# EAGLE design 40bus-nano32 (EAGLE 7.4.0)
CNAME: 40BUS-NANO32; CREVISION: r1; DESIGNER: lamloei.com/40bus-nano32
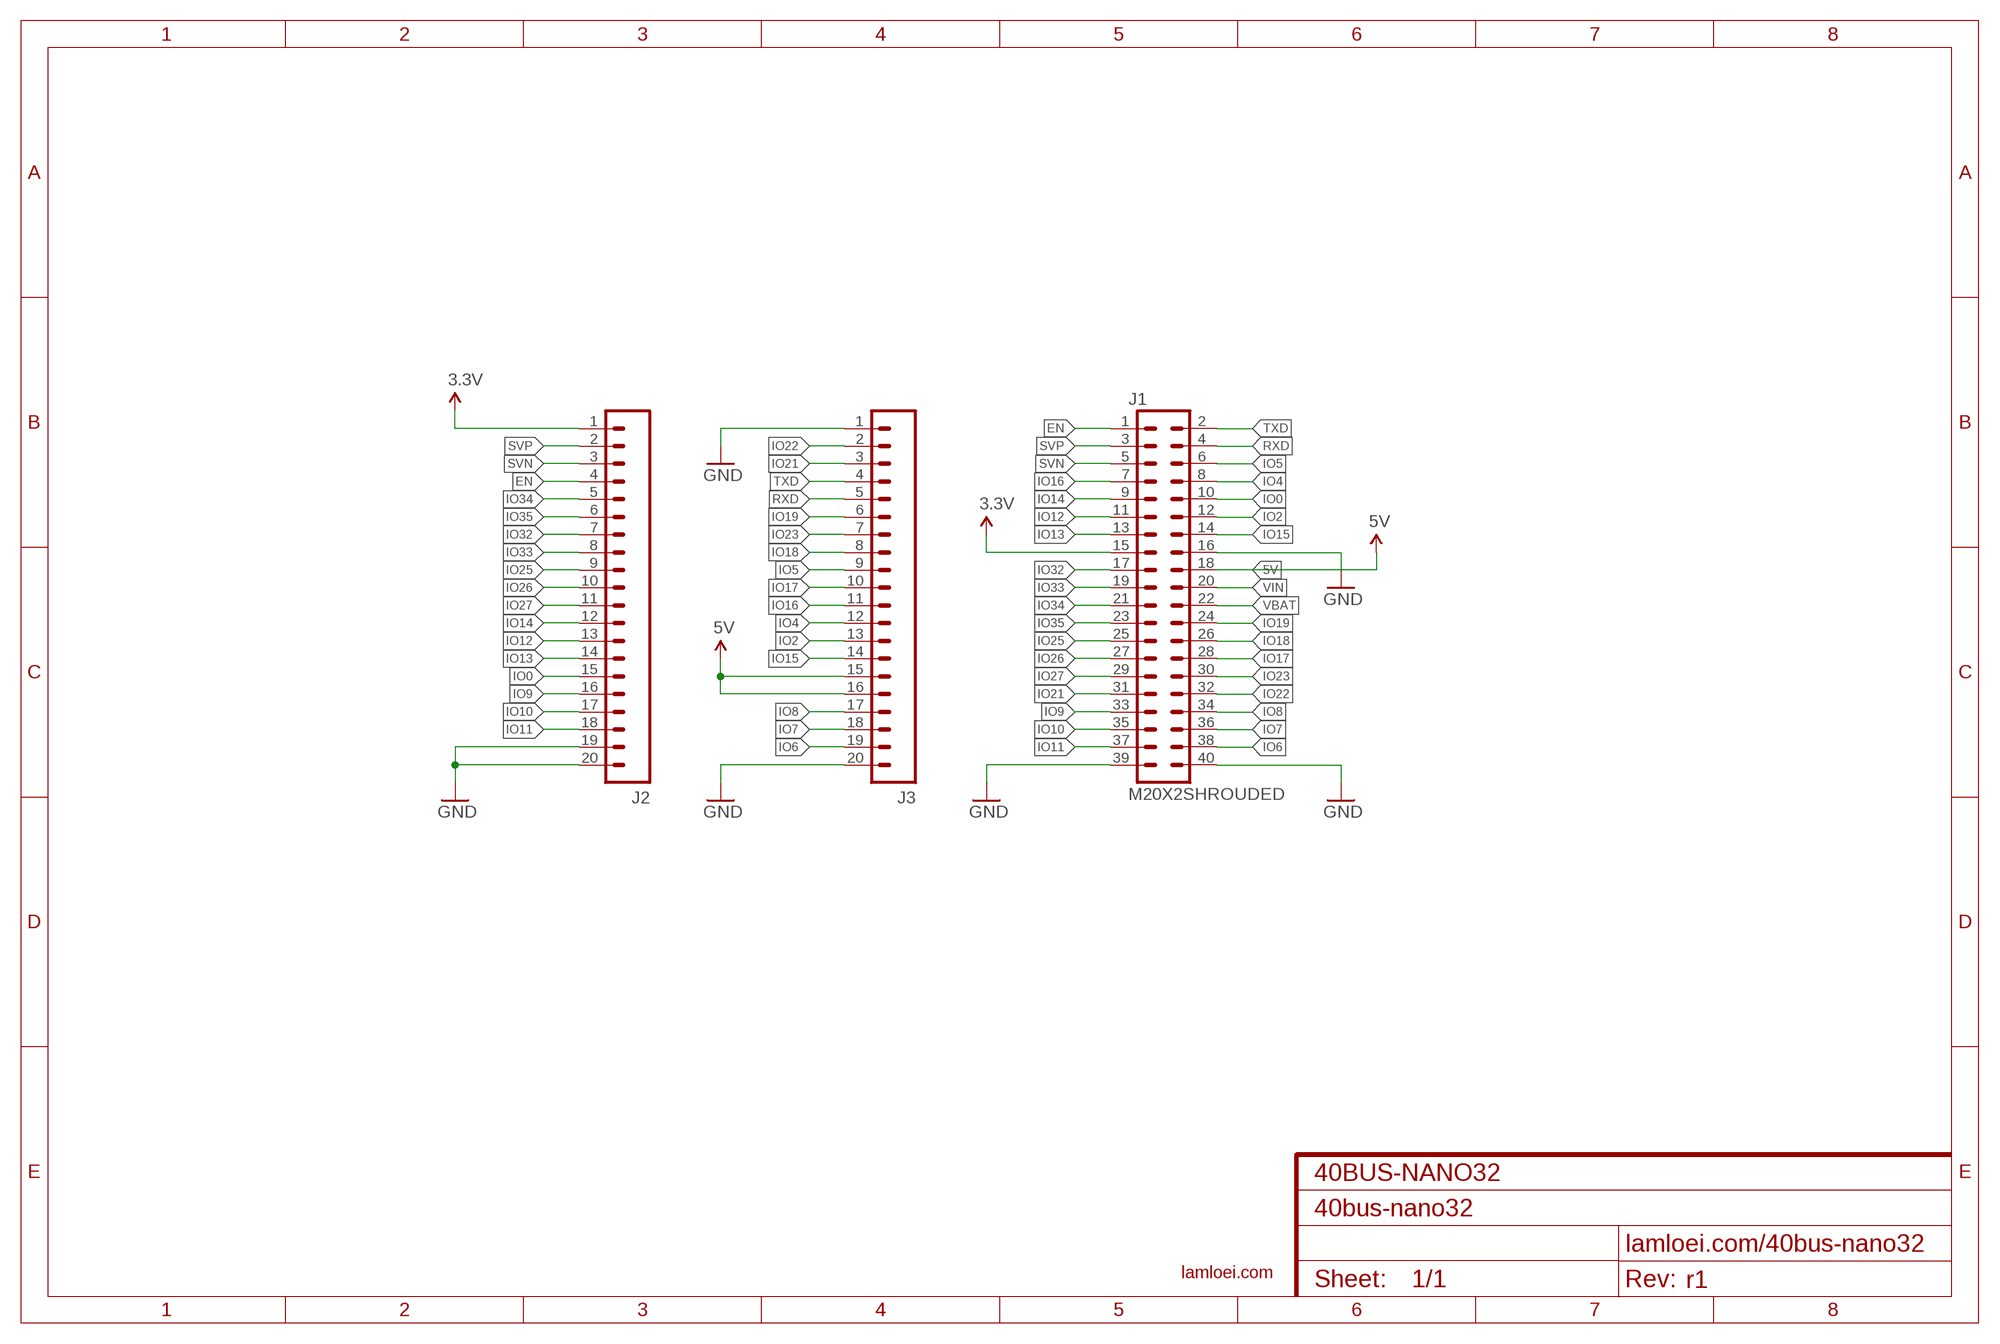
[diagram p0: schematic, sheet 1]

## Parts
J1  M20X2SHROUDED  [2X20_SHROUDED]
J2  M20  [1X20]
J3  M20  [1X20]
U$1  LAMLEOI_LOGO_3  [LAMLEOI_LOGO_3]

## Nets
3.3V: J1.15 J2.1
5V: J1.18 J3.15 J3.16
EN: J1.1 J2.4
GND: J1.16 J1.39 J1.40 J2.19 J2.20 J3.1 J3.20
IO0: J1.10 J2.15
IO2: J1.12 J3.13
IO4: J1.8 J3.12
IO5: J1.6 J3.9
IO6: J1.38 J3.19
IO7: J1.36 J3.18
IO8: J1.34 J3.17
IO9: J1.33 J2.16
IO10: J1.35 J2.17
IO11: J1.37 J2.18
IO12: J1.11 J2.13
IO13: J1.13 J2.14
IO14: J1.9 J2.12
IO15: J1.14 J3.14
IO16: J1.7 J3.11
IO17: J1.28 J3.10
IO18: J1.26 J3.8
IO19: J1.24 J3.6
IO21: J1.31 J3.3
IO22: J1.32 J3.2
IO23: J1.30 J3.7
IO25: J1.25 J2.9
IO26: J1.27 J2.10
IO27: J1.29 J2.11
IO32: J1.17 J2.7
IO33: J1.19 J2.8
IO34: J1.21 J2.5
IO35: J1.23 J2.6
RXD: J1.4 J3.5
SVN: J1.5 J2.3
SVP: J1.3 J2.2
TXD: J1.2 J3.4
VBAT: J1.22
VIN: J1.20

## Library data of the parts
J1 = SparkFun-Connectors:M20X2: 0.1" spaced headers; PROD_ID: CONN-12263
J2 J3 = SparkFun-Connectors2:M20: 1x20 .1" header This is just like the LOCK variant in that the holes are staggared by 5 mil, but except for the last two holes. They are not altered from the "standard" footprint layout. This is used for a special purpose on the layout of our Graphic LCD Backpack. Make sure you want to use this device before selecting it for you project!
U$1 = lamloei_logo_3:LAMLEOI_LOGO_3: lamloei

## Board
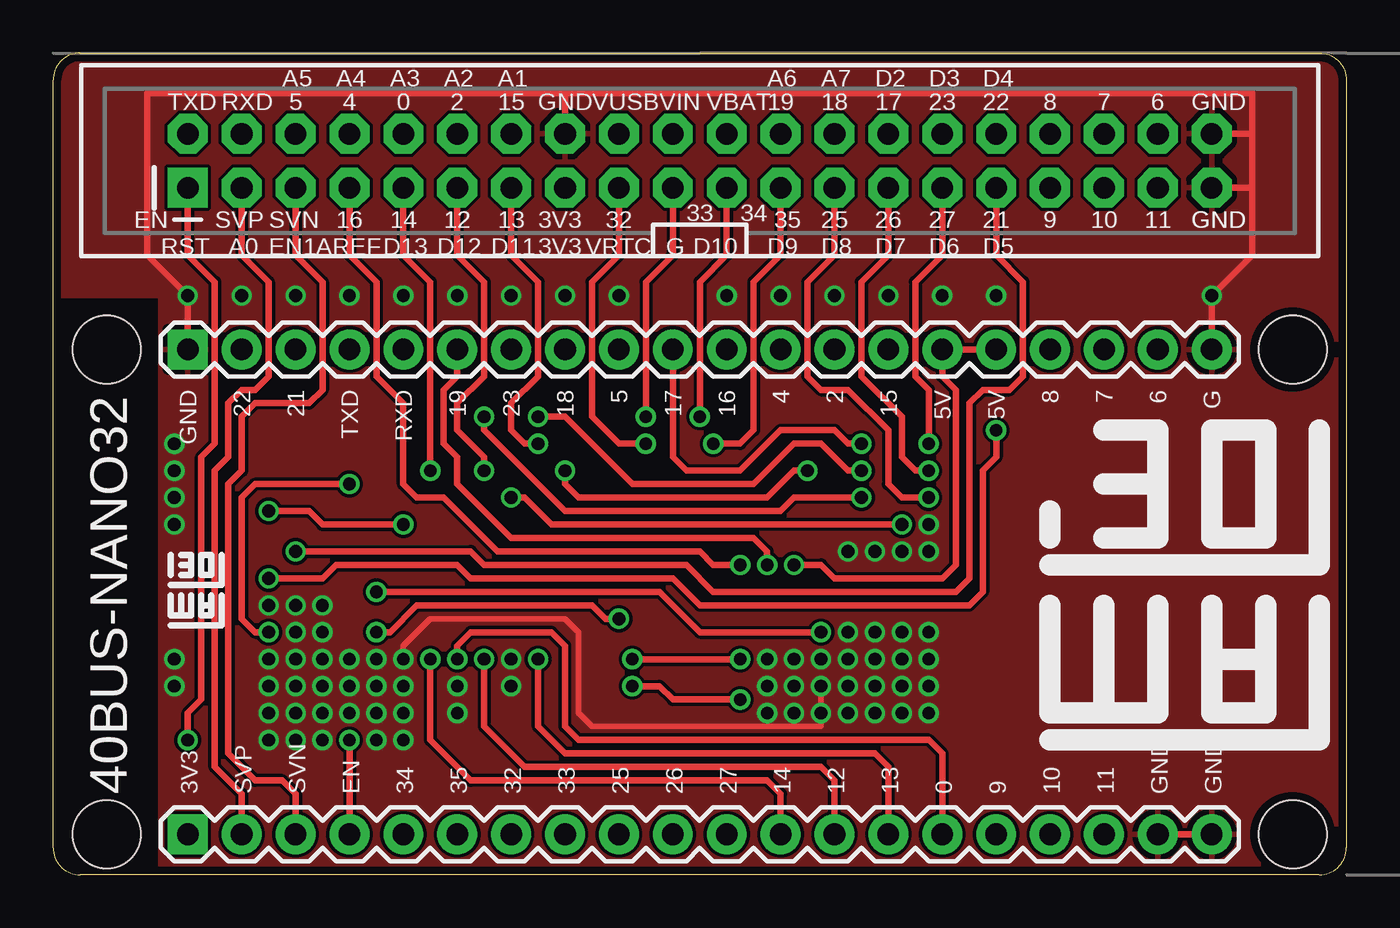
[diagram p1: board, top side]
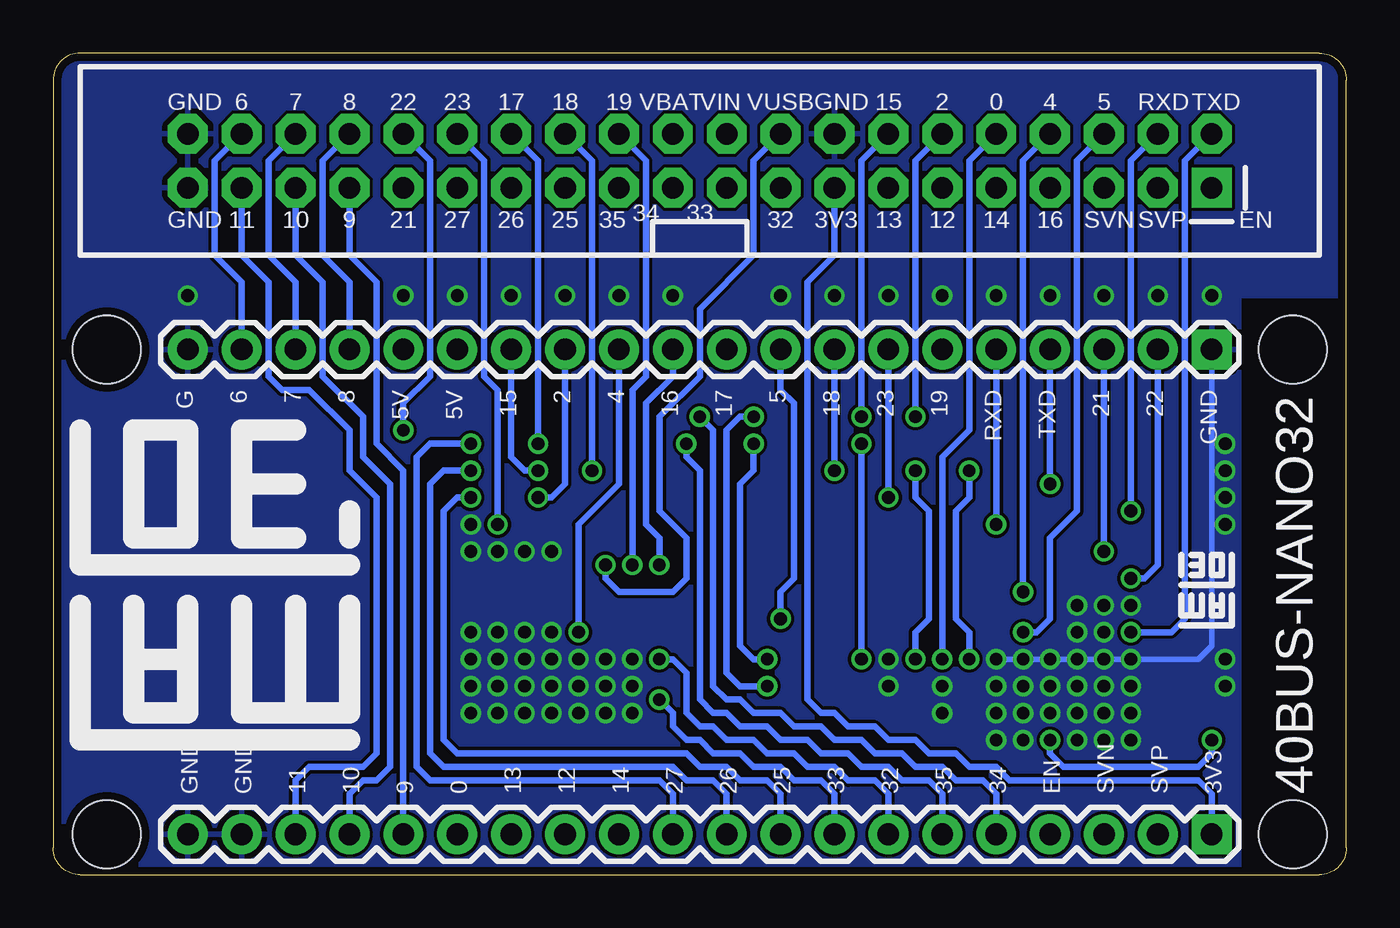
[diagram p2: board, bottom side, seen from below]

Size 60.96 x 38.73 mm. Coordinates in mm from the lower left corner, seen from the top.
Outline: 0,1.27 0,37.47 arc-90 1.27,38.73 59.69,38.73 arc-90 60.96,37.47 60.96,1.27 arc-90 59.69,0 1.27,0 arc-90 0,1.27
Copper layers (1*16): Top 0.0356mm / dielectric 1.5011mm / Bottom 0.0356mm
Design rules "PCBs_io2": minimum track width 6mil, minimum drill 13mil, track to track 6mil, track to pad 6mil, pad to pad 6mil, via to via 6mil, smd to smd 6mil, copper to edge 15mil, drill to drill 6mil, minimum pad ring 7mil, minimum via ring 7mil, stop-mask expansion 3mil, vias tented up to drill 25mil, thermal gap 10mil
Holes 3.2 mm at 2.54,1.91 2.54,24.77 58.42,1.91 58.42,24.77

### Footprints (pad centres in the part's own frame; a part is rotated, then mirrored left to right if it is on the bottom)
2X20_SHROUDED = drill 1.016 pad 1.88 square: 1 -1.27,24.13 | drill 1.016 pad 1.88 octagon: 2 1.27,24.13; 3 -1.27,21.59; 4 1.27,21.59; 5 -1.27,19.05; 6 1.27,19.05; 7 -1.27,16.51; 8 1.27,16.51; 9 -1.27,13.97; 10 1.27,13.97; 11 -1.27,11.43; 12 1.27,11.43; 13 -1.27,8.89; 14 1.27,8.89; 15 -1.27,6.35; 16 1.27,6.35; 17 -1.27,3.81; 18 1.27,3.81; 19 -1.27,1.27; 20 1.27,1.27; 21 -1.27,-1.27; 22 1.27,-1.27; 23 -1.27,-3.81; 24 1.27,-3.81; 25 -1.27,-6.35; 26 1.27,-6.35; 27 -1.27,-8.89; 28 1.27,-8.89; 29 -1.27,-11.43; 30 1.27,-11.43; 31 -1.27,-13.97; 32 1.27,-13.97; 33 -1.27,-16.51; 34 1.27,-16.51; 35 -1.27,-19.05; 36 1.27,-19.05; 37 -1.27,-21.59; 38 1.27,-21.59; 39 -1.27,-24.13; 40 1.27,-24.13
1X20 = drill 1.016 pad 1.88 square: 1 0,0 | drill 1.016 pad 1.88: 2 2.54,0; 3 5.08,0; 4 7.62,0; 5 10.16,0; 6 12.7,0; 7 15.24,0; 8 17.78,0; 9 20.32,0; 10 22.86,0; 11 25.4,0; 12 27.94,0; 13 30.48,0; 14 33.02,0; 15 35.56,0; 16 38.1,0; 17 40.64,0; 18 43.18,0; 19 45.72,0; 20 48.26,0

### Placement (x,y rotation side)
J1  30.48,33.66 90 top
J2  6.35,1.91 0 top
J3  6.35,24.77 0 top
U$1  8.26,11.43 90 top
U$2  LAMLEOI_LOGO_3  [LAMLEOI_LOGO_3]  5.08,11.43 90 bottom

### Tracks (layer width: path | path; a pad name or v marks a point on that pad's centre or on a via)
3.3V
  Bottom 0.305: J1.15 24.13,29.21 25.4,27.94 25.4,8.26 24.77,7.62 24.13,7.62 23.5,6.99 22.23,6.99 21.59,6.35 20.32,6.35 19.68,5.71 18.41,5.71 17.78,5.08 16.51,5.08 15.88,4.45 6.99,4.45 6.35,3.81 J2.1
5V  (via drill 0.6)
  Top 0.305: J3.16 J3.15 41.91,23.5 42.55,22.86 42.55,14.61 41.91,13.97 36.83,13.97 36.2,14.61 v34.92,14.61
  Bottom 0.305: J1.18 27.94,33.66 27.94,29.21 30.48,26.67 30.48,23.5 32.38,21.59 32.38,17.14 31.11,15.88 31.11,13.97 31.75,13.34 34.29,13.34 34.92,13.97 v34.92,14.61
EN  (via drill 0.6)
  Top 0.305: v13.97,6.35 J2.4 | J1.1 6.35,29.21 7.62,27.94 7.62,20.32 6.99,19.68 6.99,8.26 6.35,7.62 v6.35,6.35
  Bottom 0.305: v6.35,6.35 6.35,5.71 6.99,5.08 13.34,5.08 13.97,5.71 v13.97,6.35
GND  (via drill 0.6)
  Top 0.254: v36.2,8.89 v36.2,7.62 36.2,6.99 25.4,6.99 24.77,7.62 24.77,11.43 24.13,12.06 17.78,12.06 16.51,10.79 v16.51,10.16
  Top 0.305: J1.16 24.13,36.83 | 24.13,36.83 4.45,36.83 4.45,29.21 v6.35,27.3 J3.1 | J3.20 v54.61,27.3 56.52,29.21 56.52,32.38 | 56.52,32.38 56.52,34.92 | 56.52,34.92 56.52,36.83 24.13,36.83 | J2.19 J2.20 | J1.40 56.52,34.92 | J1.39 56.52,32.38
  Bottom 0.254: v16.51,10.16 6.99,10.16 6.35,10.79 J3.1
  other vias: 15.24,10.16 13.97,10.16 24.13,27.3 21.59,27.3 19.05,27.3 16.51,27.3 13.97,27.3 11.43,27.3 8.89,27.3 34.29,27.3 36.83,27.3 39.37,27.3 41.91,27.3 38.73,15.24 40.01,15.24 36.2,10.16 37.47,10.16 37.47,11.43 12.7,10.16 13.97,8.89 12.7,8.89 11.43,8.89 11.43,10.16 10.16,10.16 38.73,11.43 38.73,10.16 38.73,8.89 37.47,8.89 37.47,7.62 38.73,7.62 31.75,27.3 26.67,27.3 44.45,27.3 40.01,11.43 40.01,7.62 40.01,10.16 40.01,8.89 48.26,6.35 49.53,6.35 50.8,6.35 52.07,6.35 53.34,6.35 54.61,6.35 49.53,8.89 46.99,6.35 49.53,7.62 50.8,7.62 52.07,8.89 52.07,7.62 54.61,7.62 55.88,6.35 55.88,7.62 57.15,7.62 58.42,6.35 59.69,7.62 59.69,8.89 57.15,6.35 57.15,8.89 57.15,10.16 55.88,10.16 54.61,10.16 59.69,6.35 59.69,10.16 59.69,11.43 59.69,12.7 46.99,7.62 48.26,7.62 52.07,10.16 52.07,11.43 52.07,12.7 49.53,12.7 49.53,11.43 49.53,10.16 46.99,12.7 46.99,11.43 46.99,10.16 46.99,8.89 37.47,15.24 34.92,10.16 34.92,8.89 34.92,7.62 33.66,10.16 33.66,8.89 33.66,7.62 54.61,8.89 54.61,11.43 54.61,12.7 57.15,12.7 57.15,11.43 54.61,14.61 53.34,14.61 52.07,14.61 50.8,14.61 49.53,14.61 48.26,14.61 46.99,14.61 52.07,15.88 49.53,15.88 50.8,15.88 52.07,17.14 52.07,18.41 50.8,18.41 49.53,18.41 52.07,19.68 52.07,20.95 50.8,20.95 49.53,20.95 46.99,15.88 46.99,17.14 54.61,17.14 55.88,14.61 57.15,14.61 58.42,14.61 59.69,14.61 59.69,15.88 59.69,17.14 59.69,18.41 59.69,19.68 59.69,20.95 55.88,20.95 57.15,15.88 57.15,20.95 57.15,19.68 57.15,18.41 57.15,17.14 55.88,15.88 54.61,18.41 54.61,15.88 54.61,19.68 54.61,20.95 21.59,10.16 15.24,8.89 16.51,8.89 19.05,8.89 21.59,8.89 16.51,7.62 16.51,6.35 15.24,6.35 15.24,7.62 10.16,8.89 10.16,6.35 11.43,6.35 12.7,6.35 10.16,7.62 11.43,7.62 12.7,7.62 11.43,11.43 11.43,12.7 10.16,12.7 19.05,7.62 13.97,7.62 12.7,12.7 12.7,11.43 41.27,7.62 41.27,8.89 41.27,10.16 41.27,11.43 41.27,15.24 5.71,10.16 5.71,16.51 5.71,17.78 5.71,19.05 5.71,20.32 5.71,8.89 41.27,16.51
  pour Top: 5.08,0 60.96,0 60.96,38.73 0,38.73 0,27.3 5.08,27.3
  pour Bottom: 5.08,0 60.96,0 60.96,38.73 0,38.73 0,27.3 5.08,27.3
IO0  (via drill 0.6)
  Top 0.305: J2.15 41.91,5.71 41.27,6.35 24.77,6.35 24.13,6.99 24.13,10.79 23.5,11.43 19.68,11.43 19.05,10.79 v19.05,10.16
  Bottom 0.305: J1.10 17.78,33.66 17.78,20.95 19.05,19.68 v19.05,10.16
IO2  (via drill 0.6)
  Top 0.305: v20.32,21.59 20.32,20.95 24.13,17.14 34.29,17.14 34.92,17.78 v38.1,17.78
  Bottom 0.305: J1.12 20.32,33.66 v20.32,21.59 | v38.1,17.78 37.47,17.78 36.83,18.41 J3.13
IO4  (via drill 0.6)
  Top 0.305: v15.24,13.34 28.57,13.34 30.48,11.43 v36.2,11.43
  Bottom 0.305: J1.8 15.24,33.66 v15.24,13.34 | J3.12 34.29,18.41 36.2,16.51 v36.2,11.43
IO5  (via drill 0.6)
  Top 0.305: v26.67,12.06 26.04,12.06 25.4,12.7 17.14,12.7 15.88,11.43 v15.24,11.43
  Bottom 0.305: J1.6 12.7,33.66 12.7,17.14 13.97,15.88 13.97,12.06 14.61,11.43 v15.24,11.43 | J3.9 26.67,22.86 26.04,22.23 26.04,13.97 26.67,13.34 v26.67,12.06
IO6
  Bottom 0.305: J1.38 53.34,33.66 53.34,29.21 52.07,27.94 J3.19
IO7
  Bottom 0.305: J1.36 50.8,33.66 50.8,29.21 49.53,27.94 J3.18
IO8
  Bottom 0.305: J1.34 48.26,33.66 48.26,29.21 46.99,27.94 J3.17
IO9
  Bottom 0.305: J1.33 46.99,29.21 45.72,27.94 45.72,20.32 44.45,19.05 J2.16
IO10
  Bottom 0.305: J1.35 49.53,29.21 48.26,27.94 48.26,23.5 46.35,21.59 46.35,19.68 45.09,18.41 45.09,5.08 45.72,4.45 46.35,4.45 46.99,3.81 J2.17
IO11
  Bottom 0.305: J1.37 52.07,29.21 50.8,27.94 50.8,23.5 50.16,22.86 48.9,22.86 46.99,20.95 46.99,19.05 45.72,17.78 45.72,5.71 46.35,5.08 48.9,5.08 49.53,4.45 J2.18
IO12  (via drill 0.6)
  Top 0.305: J1.11 19.05,29.21 20.32,27.94 20.32,23.5 19.05,22.23 19.05,20.95 20.32,19.68 v20.32,19.05 | J2.13 36.83,4.45 36.2,5.08 22.23,5.08 20.32,6.99 v20.32,10.16
  Bottom 0.305: v20.32,10.16 20.32,11.43 19.68,12.06 19.68,17.14 20.32,17.78 v20.32,19.05
IO13  (via drill 0.6)
  Top 0.305: J1.13 21.59,29.21 22.86,27.94 22.86,23.5 21.59,22.23 21.59,20.95 22.23,20.32 v22.86,20.32 | J2.14 39.37,5.08 38.73,5.71 24.13,5.71 22.86,6.99 v22.86,10.16
  Bottom 0.305: v22.86,10.16 v22.86,20.32
IO14  (via drill 0.6)
  Top 0.305: J1.9 16.51,29.21 17.78,27.94 v17.78,19.05 | J2.12 34.29,3.81 33.66,4.45 19.68,4.45 17.78,6.35 v17.78,10.16
  Bottom 0.305: v17.78,10.16 17.78,11.43 18.41,12.06 18.41,17.14 17.78,17.78 v17.78,19.05
IO15  (via drill 0.6)
  Top 0.305: v22.86,21.59 24.13,21.59 27.3,18.41 33.02,18.41 34.92,20.32 36.2,20.32 37.47,19.05 v38.1,19.05
  Bottom 0.305: J1.14 22.86,33.66 v22.86,21.59 | v38.1,19.05 38.73,19.05 39.37,19.68 J3.14
IO16  (via drill 0.6)
  Top 0.305: J1.7 13.97,29.21 15.24,27.94 15.24,23.5 16.51,22.23 16.51,18.41 17.14,17.78 18.41,17.78 20.95,15.24 30.48,15.24 31.11,14.61 v32.38,14.61
  Bottom 0.305: J3.11 31.75,23.5 33.02,22.23 33.02,16.51 32.38,15.88 v32.38,14.61
IO17  (via drill 0.6)
  Top 0.305: J3.10 29.21,19.68 29.84,19.05 32.38,19.05 34.29,20.95 36.83,20.95 37.47,20.32 v38.1,20.32
  Bottom 0.305: v38.1,20.32 38.1,33.66 J1.28
IO18  (via drill 0.6)
  Top 0.305: v35.56,19.05 34.92,19.05 33.66,17.78 24.77,17.78 24.13,18.41 v24.13,19.05
  Bottom 0.305: J1.26 35.56,33.66 v35.56,19.05 | v24.13,19.05 J3.8
IO19  (via drill 0.6)
  Top 0.305: J3.6 19.05,23.5 18.41,22.86 18.41,20.32 19.05,19.68 19.05,18.41 21.59,15.88 33.02,15.88 33.66,15.24 v33.66,14.61
  Bottom 0.305: J1.24 33.02,33.66 33.02,23.5 33.66,22.86 v33.66,14.61
IO21  (via drill 0.6)
  Top 0.305: J1.31 44.45,29.21 45.72,27.94 45.72,23.5 45.09,22.86 43.81,22.86 43.18,22.23 43.18,13.97 42.55,13.34 31.11,13.34 29.84,14.61 20.32,14.61 19.68,15.24 v11.43,15.24
  Bottom 0.305: J3.3 v11.43,15.24
IO22  (via drill 0.6)
  Top 0.305: v44.45,20.95 44.45,19.68 43.81,19.05 43.81,13.34 43.18,12.7 30.48,12.7 29.21,13.97 19.68,13.97 19.05,14.61 13.34,14.61 12.7,13.97 v10.16,13.97
  Bottom 0.305: J1.32 43.18,33.66 43.18,23.5 44.45,22.23 v44.45,20.95 | v10.16,13.97 9.53,13.97 8.89,14.61 J3.2
IO23  (via drill 0.6)
  Top 0.305: v21.59,17.78 22.23,17.78 23.5,16.51 v40.01,16.51
  Bottom 0.305: J1.30 40.64,33.66 40.64,23.5 40.01,22.86 v40.01,16.51 | v21.59,17.78 J3.7
IO25  (via drill 0.6)
  Top 0.305: J1.25 36.83,29.21 35.56,27.94 35.56,23.5 36.2,22.86 37.47,22.86 39.37,20.95 39.37,18.41 40.01,17.78 v41.27,17.78
  Bottom 0.305: v41.27,17.78 41.91,17.78 42.55,17.14 42.55,6.35 41.91,5.71 31.11,5.71 30.48,5.08 29.21,5.08 28.57,4.45 27.3,4.45 26.67,3.81 J2.9
IO26  (via drill 0.6)
  Top 0.305: J1.27 39.37,29.21 38.1,27.94 38.1,23.5 40.01,21.59 40.01,19.68 40.64,19.05 v41.27,19.05
  Bottom 0.305: J2.10 29.21,3.81 29.84,4.45 31.11,4.45 31.75,5.08 42.55,5.08 42.86,5.4 43.18,5.71 43.18,18.41 42.55,19.05 v41.27,19.05
IO27  (via drill 0.6)
  Top 0.305: J1.29 41.91,29.21 40.64,27.94 40.64,23.5 41.27,22.86 v41.27,20.32
  Bottom 0.305: J2.11 31.75,3.81 32.38,4.45 43.18,4.45 43.81,5.08 43.81,19.68 43.18,20.32 v41.27,20.32
IO32  (via drill 0.6)
  Top 0.305: J1.17 26.67,29.21 25.4,27.94 25.4,21.59 26.67,20.32 v27.94,20.32 | v27.3,10.16 v32.38,10.16
  Bottom 0.305: J2.7 21.59,3.81 22.23,4.45 23.5,4.45 24.13,5.08 25.4,5.08 26.04,5.71 27.3,5.71 27.94,6.35 29.21,6.35 29.84,6.99 30.48,6.99 31.11,7.62 31.11,9.53 31.75,10.16 v32.38,10.16 | v27.94,20.32 27.94,19.05 28.57,18.41 28.57,10.79 27.94,10.16 v27.3,10.16
IO33  (via drill 0.6)
  Top 0.305: J1.19 29.21,29.21 27.94,27.94 v27.94,21.59 | v27.3,8.89 28.57,8.89 29.21,8.26 v32.38,8.26
  Bottom 0.305: v27.94,21.59 28.57,21.59 29.21,20.95 29.21,9.53 28.57,8.89 v27.3,8.89 | v32.38,8.26 31.75,7.62 31.75,6.99 31.11,6.35 30.48,6.35 29.84,5.71 28.57,5.71 27.94,5.08 26.67,5.08 26.04,4.45 24.77,4.45 24.13,3.81 J2.8
IO34  (via drill 0.6)
  Top 0.305: J1.21 31.75,29.21 30.48,27.94 v30.48,21.59
  Bottom 0.305: J2.5 16.51,3.81 17.14,4.45 18.41,4.45 19.05,5.08 20.32,5.08 20.95,5.71 22.23,5.71 22.86,6.35 24.13,6.35 24.77,6.99 26.04,6.99 26.67,7.62 27.94,7.62 28.57,8.26 29.21,8.26 29.84,8.89 29.84,20.95 v30.48,21.59
IO35  (via drill 0.6)
  Top 0.305: J1.23 34.29,29.21 33.02,27.94 33.02,20.95 32.38,20.32 v31.11,20.32
  Bottom 0.305: J2.6 19.05,3.81 19.68,4.45 20.95,4.45 21.59,5.08 22.86,5.08 23.5,5.71 24.77,5.71 25.4,6.35 26.67,6.35 27.3,6.99 28.57,6.99 29.21,7.62 29.84,7.62 30.48,8.26 30.48,19.05 31.11,19.68 v31.11,20.32
RXD  (via drill 0.6)
  Top 0.305: v10.16,17.14 12.06,17.14 12.7,16.51 v16.51,16.51
  Bottom 0.305: J1.4 10.16,33.66 v10.16,17.14 | J3.5 v16.51,16.51
SVN
  Top 0.305: J2.3 11.43,3.81 10.79,4.45 9.53,4.45 8.26,5.71 8.26,18.41 8.89,19.05 8.89,21.59 9.53,22.23 12.06,22.23 12.7,22.86 12.7,27.94 11.43,29.21 J1.5
SVP
  Top 0.305: J2.2 8.89,3.81 7.62,5.08 7.62,19.05 8.26,19.68 8.26,22.23 8.89,22.86 9.53,22.86 10.16,23.5 10.16,27.94 8.89,29.21 J1.3
TXD  (via drill 0.6)
  Top 0.305: v13.97,18.41 9.53,18.41 8.89,17.78 8.89,12.06 9.53,11.43 v10.16,11.43
  Bottom 0.305: J1.2 7.62,33.66 7.62,12.06 8.26,11.43 v10.16,11.43 | v13.97,18.41 J3.4

### Text on the board
tPlace: A5 | A4 | A3 | A2 | A1 | A6 | A7 | D2 | D3 | D4 | TXD | RXD | 5 | 4 | 0 | 2 | 15 | GND | VUSB | VIN | VBAT | 19 | 18 | 17 | 23 | 22 | 8 | 7 | 6 | GND | 33 | 34 | EN | SVP | SVN | 16 | 14 | 12 | 12 | 13 | 3V3 | 32 | 35 | 25 | 26 | 27 | 21 | 9 | 10 | 11 | GND | GND | RST | A0 | EN1 | AREF | D13 | D12 | D11 | 3V3 | VRTC | G | D10 | D9 | D8 | D7 | D6 | D5 | GND | 22 | 21 | TXD | RXD | 19 | 23 | 18 | 5 | 17 | 16 | 4 | 2 | 15 | 5V | 5V | 8 | 7 | 6 | G | 40BUS-NANO32 | 3V3 | SVP | SVN | EN | 34 | 35 | 32 | 33 | 25 | 26 | 27 | 14 | 12 | 13 | 0 | 9 | 10 | 11 | GND | GND
bPlace: TXD | RXD | 5 | 4 | 0 | 2 | 15 | GND | VUSB | VIN | VBAT | 19 | 18 | 17 | 23 | 22 | 8 | 7 | 6 | GND | 33 | 34 | EN | SVP | SVN | 16 | 14 | 12 | 13 | 3V3 | 32 | 35 | 25 | 26 | 27 | 21 | 9 | 10 | 11 | GND | GND | 22 | 21 | TXD | RXD | 19 | 23 | 18 | 5 | 17 | 16 | 4 | 2 | 15 | 5V | 5V | 8 | 7 | 6 | G | 40BUS-NANO32 | 3V3 | SVP | SVN | EN | 34 | 35 | 32 | 33 | 25 | 26 | 27 | 14 | 12 | 13 | 0 | 9 | 10 | 11 | GND | GND